# Altium schematic sheet CT_MET_2.SchDoc
size A4
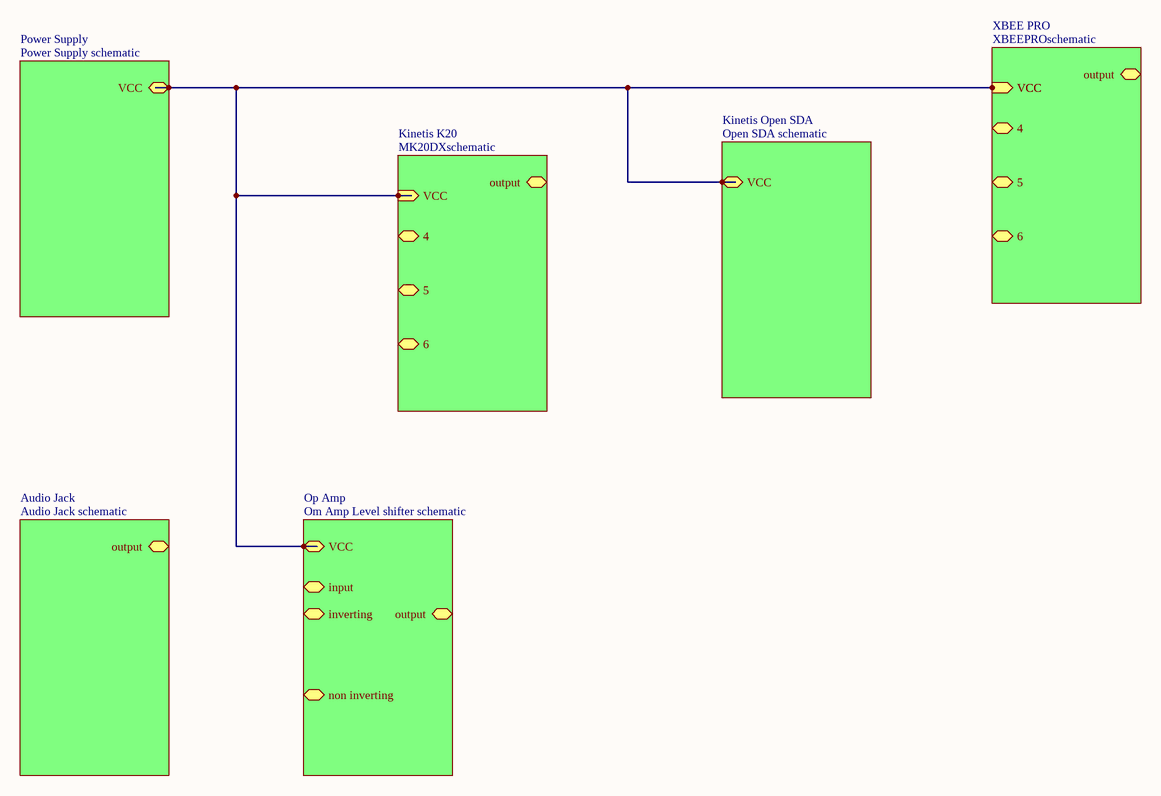
[diagram p0: CT_MET_2.SchDoc]

## Sub-sheets
Audio Jack = Audio Jack schematic: output
Kinetis K20 = MK20DXschematic: output, 4, 5, 6, VCC (in)
Kinetis Open SDA = Open SDA schematic: VCC
Op Amp = Om Amp Level shifter schematic: inverting, output, non inverting, VCC, input
Power Supply = Power Supply schematic: VCC
XBEE PRO = XBEEPROschematic: output, VCC, 4, 5, 6, VCC (in)

## Nets
(unnamed): sheet Op Amp/VCC, sheet Power Supply/VCC, sheet Kinetis K20/VCC, sheet XBEE PRO/VCC, sheet XBEE PRO/VCC, sheet Kinetis Open SDA/VCC